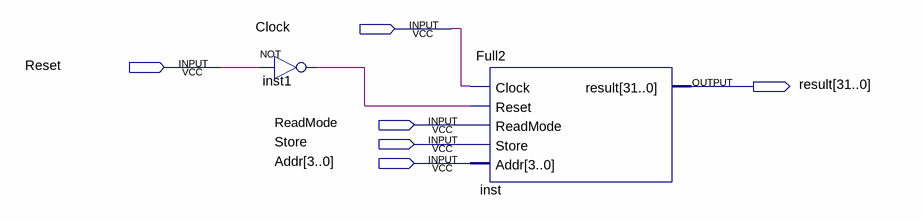
[diagram p0: schematic sheet]
// Quartus schematic Chrono.bdf as structural Verilog: 2 symbols, 6 pins
module Chrono (
  input  Clock,
  input  Reset,
  input  ReadMode,
  input  Store,
  input  [3:0] Addr,
  output [31:0] result
);

  wire inst1_out;

  not inst1 (inst1_out, Reset);
  Full2 inst (.Clock(Clock), .Reset(inst1_out), .ReadMode(ReadMode), .Store(Store), .Addr(Addr), .result(result));
endmodule
